# EAGLE schematic source_eagle (EAGLE 9.6.2)
COMPANY: ADAFRUIT INDUSTRIES; DRAWN: KTOWN; REV: A
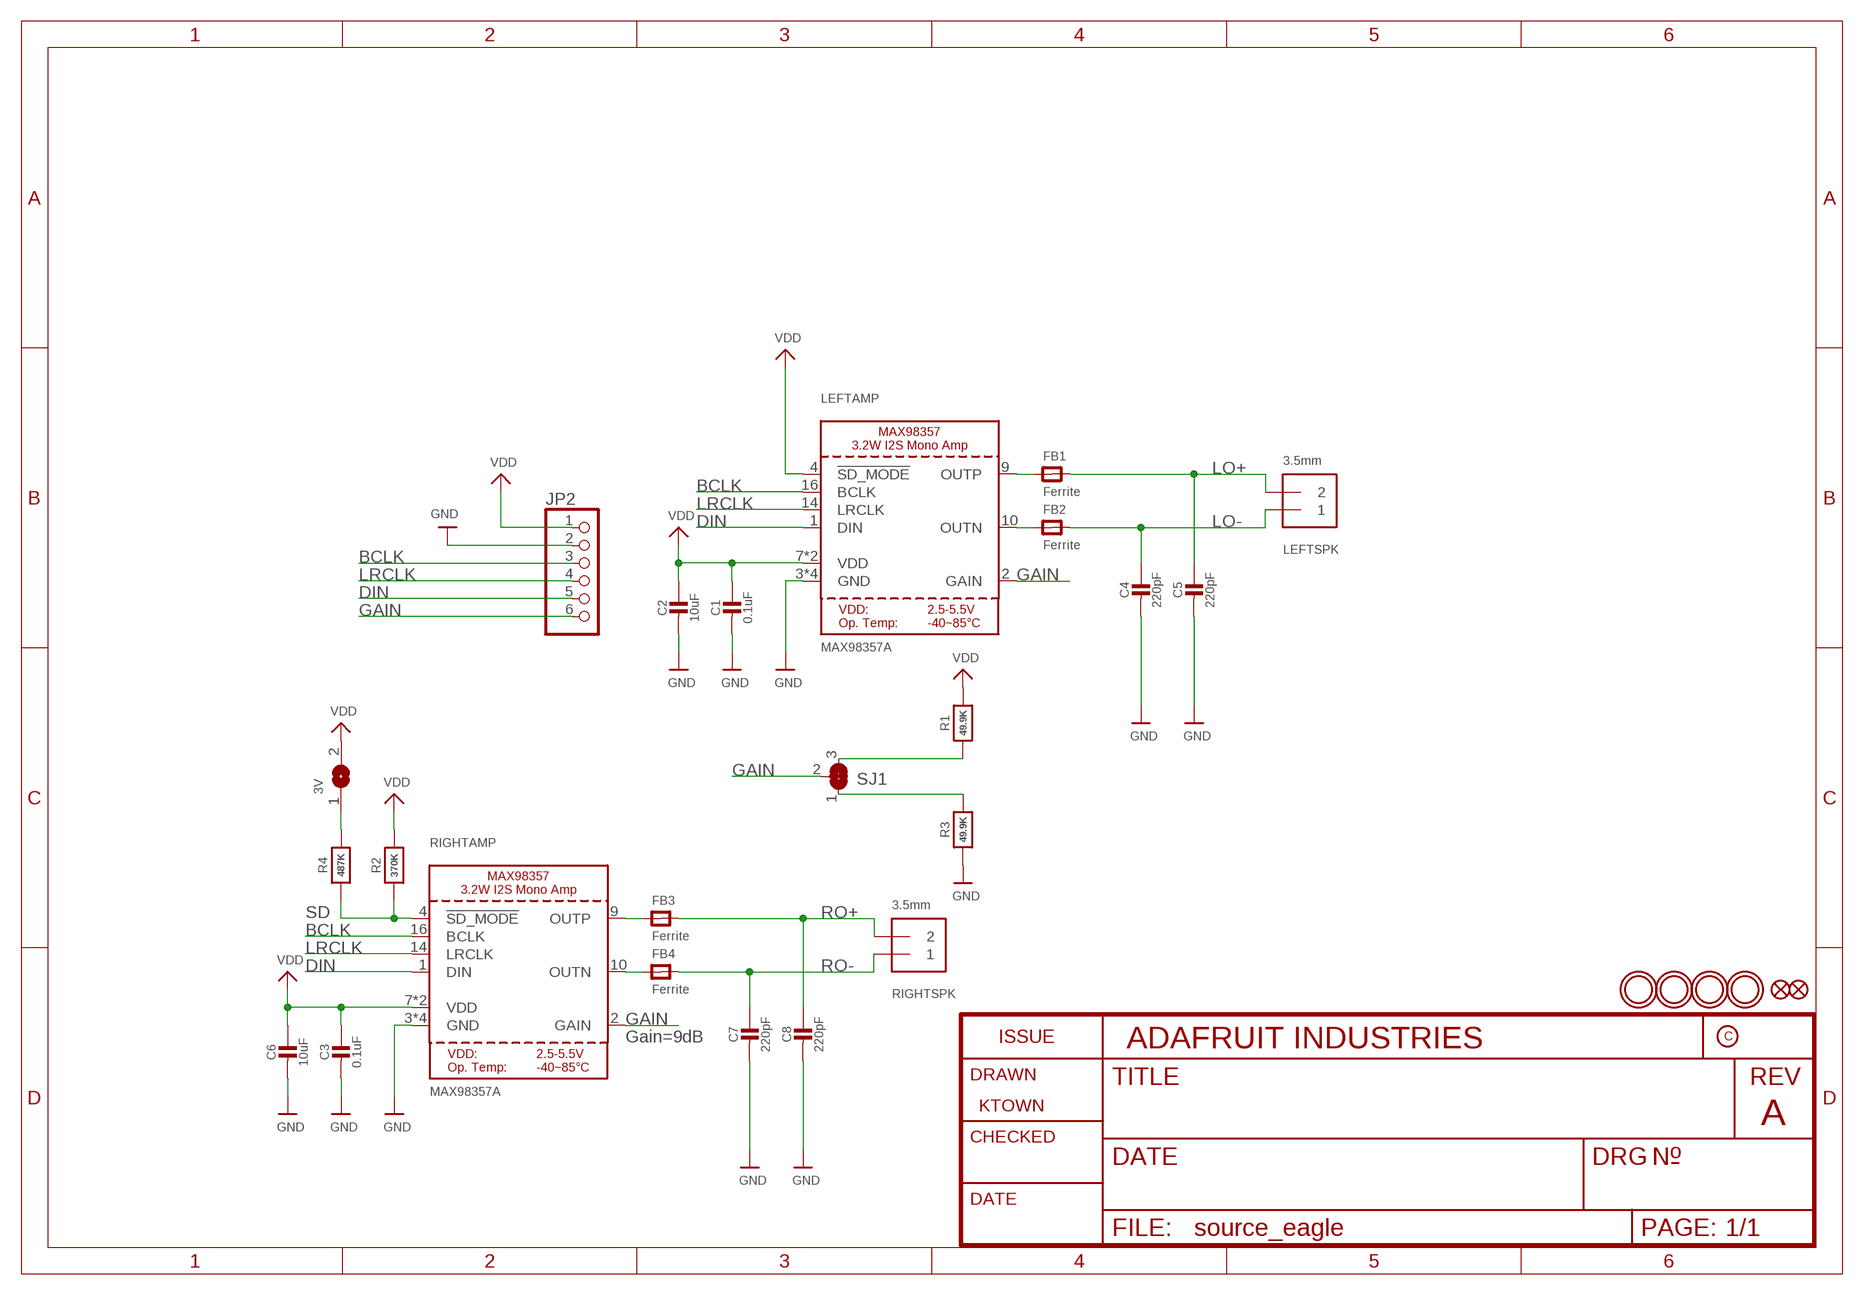
[diagram p0: schematic, sheet 1]

## Parts
3V  SOLDERJUMPER  [SOLDERJUMPER_ARROW_NOPASTE]
C1  0.1uF  CAP_CERAMIC0603_NO  [0603-NO]
C2  10uF  CAP_CERAMIC0805-NOOUTLINE  [0805-NO]
C3  0.1uF  CAP_CERAMIC0603_NO  [0603-NO]
C4  220pF  CAP_CERAMIC0603_NO  [0603-NO]
C5  220pF  CAP_CERAMIC0603_NO  [0603-NO]
C6  10uF  CAP_CERAMIC0805-NOOUTLINE  [0805-NO]
C7  220pF  CAP_CERAMIC0603_NO  [0603-NO]
C8  220pF  CAP_CERAMIC0603_NO  [0603-NO]
FB1  Ferrite  FERRITE-0603NO  [0603-NO]
FB2  Ferrite  FERRITE-0603NO  [0603-NO]
FB3  Ferrite  FERRITE-0603NO  [0603-NO]
FB4  Ferrite  FERRITE-0603NO  [0603-NO]
FID1  FIDUCIAL_0.5MM  [FIDUCIAL_0.5MM]
FID2  FIDUCIAL_0.5MM  [FIDUCIAL_0.5MM]
JP2  HEADER-1X670MIL  [1X06_ROUND_70]
LEFTAMP  MAX98357A  AUDIOAMP_MAX98357  [QFN16_3MM]
LEFTSPK  3.5mm  TERMBLOCK_1X2_3.5MM  [TERMBLOCK_1X2-3.5MM]
R1  49.9K  RESISTOR_0603_NOOUT  [0603-NO]
R2  370K  RESISTOR_0603_NOOUT  [0603-NO]
R3  49.9K  RESISTOR_0603_NOOUT  [0603-NO]
R4  487K  RESISTOR_0603_NOOUT  [0603-NO]
RIGHTAMP  MAX98357A  AUDIOAMP_MAX98357  [QFN16_3MM]
RIGHTSPK  3.5mm  TERMBLOCK_1X2_3.5MM  [TERMBLOCK_1X2-3.5MM]
SJ1  SOLDERJUMPER_2WAY  [SOLDERJUMPER_2WAY_OPEN_NOPASTE]
U$9  MOUNTINGHOLE2.5  [MOUNTINGHOLE_2.5_PLATED]
U$10  MOUNTINGHOLE2.5  [MOUNTINGHOLE_2.5_PLATED]
U$23  MOUNTINGHOLE2.5  [MOUNTINGHOLE_2.5_PLATED]
U$24  MOUNTINGHOLE2.5  [MOUNTINGHOLE_2.5_PLATED]

## Nets
BCLK: JP2.3 LEFTAMP.16(BCLK) RIGHTAMP.16(BCLK)
DIN: JP2.5 LEFTAMP.1(DIN) RIGHTAMP.1(DIN)
GAIN: JP2.6 LEFTAMP.2(GAIN) RIGHTAMP.2(GAIN) SJ1.2
GND: C1.2 C2.2 C3.2 C4.2 C5.2 C6.2 C7.2 C8.2 JP2.2 LEFTAMP.3(GND) LEFTAMP.11(GND) LEFTAMP.15(GND) LEFTAMP.THERMAL(GND) R3.1 RIGHTAMP.3(GND) RIGHTAMP.11(GND) RIGHTAMP.15(GND) RIGHTAMP.THERMAL(GND)
LO+: C5.1 FB1.2 LEFTSPK.2
LO-: C4.1 FB2.2 LEFTSPK.1
LRCLK: JP2.4 LEFTAMP.14(LRCLK) RIGHTAMP.14(LRCLK)
N$1: FB4.1 RIGHTAMP.10(OUTN)
N$2: FB3.1 RIGHTAMP.9(OUTP)
N$3: R3.2 SJ1.1
N$4: 3V.1 R4.2
N$5: FB2.1 LEFTAMP.10(OUTN)
N$6: FB1.1 LEFTAMP.9(OUTP)
N$7: R1.1 SJ1.3
RO+: C8.1 FB3.2 RIGHTSPK.2
RO-: C7.1 FB4.2 RIGHTSPK.1
SD: R2.1 R4.1 RIGHTAMP.4(!SD_MODE)
VDD: 3V.2 C1.1 C2.1 C3.1 C6.1 JP2.1 LEFTAMP.4(!SD_MODE) LEFTAMP.7(VDD) LEFTAMP.8(VDD) R1.2 R2.2 RIGHTAMP.7(VDD) RIGHTAMP.8(VDD)

## Notes on the sheet
- Gain=9dB

## Library data of the parts
3V = microbuilder:SOLDERJUMPER: SMD Solder JUMPER Solder the two pads together to create a connection, or remove the solder to break it. REFLOW - Use this footprint for solder paste and reflow ovens. WAVE - Use this footprint for hand-soldering (larger pads). CLOSED - Has a trace between the two pads to ensure it is closed by default. The trace needs to be cut to disable the jumper, and can be closed again by creating a solder bridge between the two pads.; BOM: EXCLUDE
C1-C8 = microbuilder:CAP_CERAMIC: Ceramic Capacitors For new designs, use the packages preceded by an '_' character since they are more reliable: The following footprints should be used on most boards: _0402 - Standard footprint for regular board layouts _0603 - Standard footprint for regular board layouts _0805 - Standard footprint for regular board layouts _1206 - Standard footprint for regular board layouts For extremely tight-pitch boards where space is at a premium, the following 'micro-pitch' footprints can be used (smaller pads, no silkscreen outline, etc.): _0402MP - Micro-pitch footprint for very dense/compact boards _0603MP - Micro-pitch footprint for very dense/compact boards _0805MP - Micro-pitch footprint for very dense/compact boards _1206MP - Micro-pitch footprint for very dense/compact boards
FB1-FB4 = microbuilder:FERRITE: Ferrite Bead 0603 MMZ1608B121C - 120 Ohm @ 100MHz, 600mA, 0.15 Ohm DC Resistance - Digikey: 445-2164-1-ND BK1608HW121-T - 120 Ohm, 600mA Ferrite Chip - Digikey: 587-1876-2-ND 0805 HZ0805B272R-10 - 2.7K Ohm @ 100MHz, 200mA, 0.8 Ohm DC Resistance - Digikey: 240-2504-1-ND (see also Murata BLM21BD272SN1L) MMZ2012Y152B - 1.5K Ohm @ 100MHz, 500mA, 0.4 Ohm DC Resistance - Digikey: 445-1560-1-ND - Mainly for high frequency (80-400MHz) MMZ2012R102A - 1K Ohm @ 100MHz, 500mA, 0.3 Ohm DC Resistance - Digikey: 445-1555-2-ND - More general purpose (10-200MHz)
FID1 FID2 = microbuilder:FIDUCIAL: Fiducial Alignment Points Various fiducial points for machine vision alignment.
JP2 = microbuilder:HEADER-1X6: PIN HEADER
LEFTAMP RIGHTAMP = microbuilder:AUDIOAMP_MAX98357: MAX98357 - 3.2W I2S Mono Audio Amp; ROT: 270
LEFTSPK RIGHTSPK = adafruit_electromech:TERMBLOCK_1X2: 3.5mm Terminal block http://www.ladyada.net/library/pcb/eaglelibrary.html
R1-R4 = microbuilder:RESISTOR: Resistors For new designs, use the packages preceded by an '_' character since they are more reliable: The following footprints should be used on most boards: _0402 - Standard footprint for regular board layouts _0603 - Standard footprint for regular board layouts _0805 - Standard footprint for regular board layouts _1206 - Standard footprint for regular board layouts For extremely tight-pitch boards where space is at a premium, the following 'micro-pitch' footprints can be used (smaller pads, no silkscreen outline, etc.): _0402MP - Micro-pitch footprint for very dense/compact boards _0603MP - Micro-pitch footprint for very dense/compact boards _0805MP - Micro-pitch footprint for very dense/compact boards _1206MP - Micro-pitch footprint for very dense/compact boards
SJ1 = microbuilder:SOLDERJUMPER_2WAY: 2-Way Solder Jumper
U$9 U$10 U$23 U$24 = adafruit_electromech:MOUNTINGHOLE: Mounting Hole For #2 screws (0.086"/2.18mm width, 0.094"/2.4mm hole) use 2.5mm; BOM: EXCLUDE